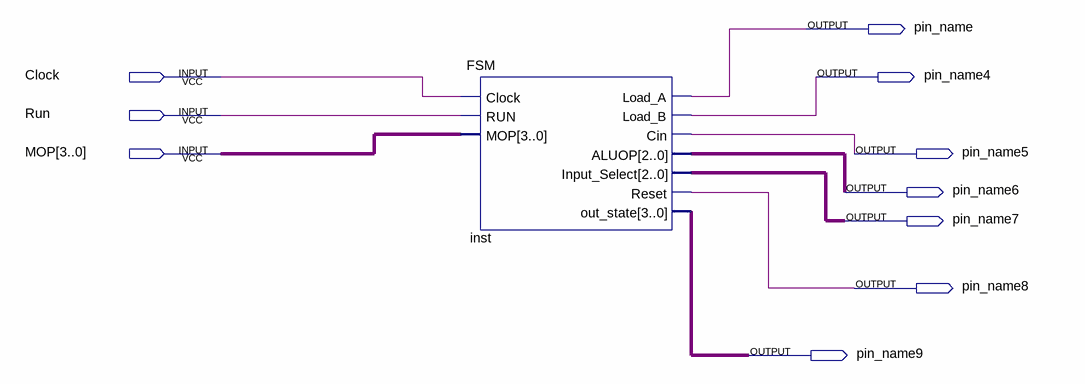
[diagram p0: schematic sheet]
// Quartus schematic FSM.bdf as structural Verilog: 1 symbols, 10 pins
module FSM (
  input  Clock,
  input  Run,
  input  [3:0] MOP,
  output pin_name,
  output pin_name4,
  output pin_name5,
  output pin_name6,
  output pin_name7,
  output pin_name8,
  output pin_name9
);

  wire [2:0] inst_aluop, inst_input_select;
  wire [3:0] inst_out_state;

  FSM inst (
    .Clock(Clock), .RUN(Run), .MOP(MOP), .Load_A(pin_name), .Load_B(pin_name4), .Cin(pin_name5),
    .ALUOP(inst_aluop), .Input_Select(inst_input_select), .Reset(pin_name8), .out_state(inst_out_state));
endmodule
